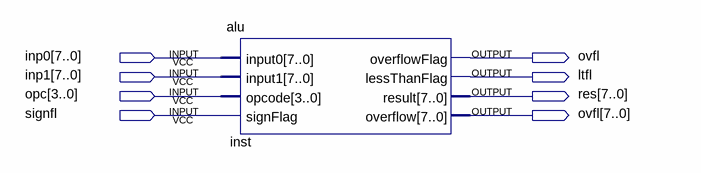
[diagram p0: schematic sheet]
// Quartus schematic CS141Ldup.bdf as structural Verilog: 1 symbols, 8 pins
module CS141Ldup (
  input  [7:0] inp0,
  input  [7:0] inp1,
  input  [3:0] opc,
  input  signfl,
  output ovfl_1bit,
  output ltfl,
  output [7:0] res,
  output [7:0] ovfl
);

  alu inst (
    .input0(inp0), .input1(inp1), .opcode(opc), .signFlag(signfl), .overflowFlag(ovfl_1bit),
    .lessThanFlag(ltfl), .result(res), .overflow(ovfl));
endmodule
